# Altium schematic sheet STM8S005C6_Footsprint.schdoc
size A4
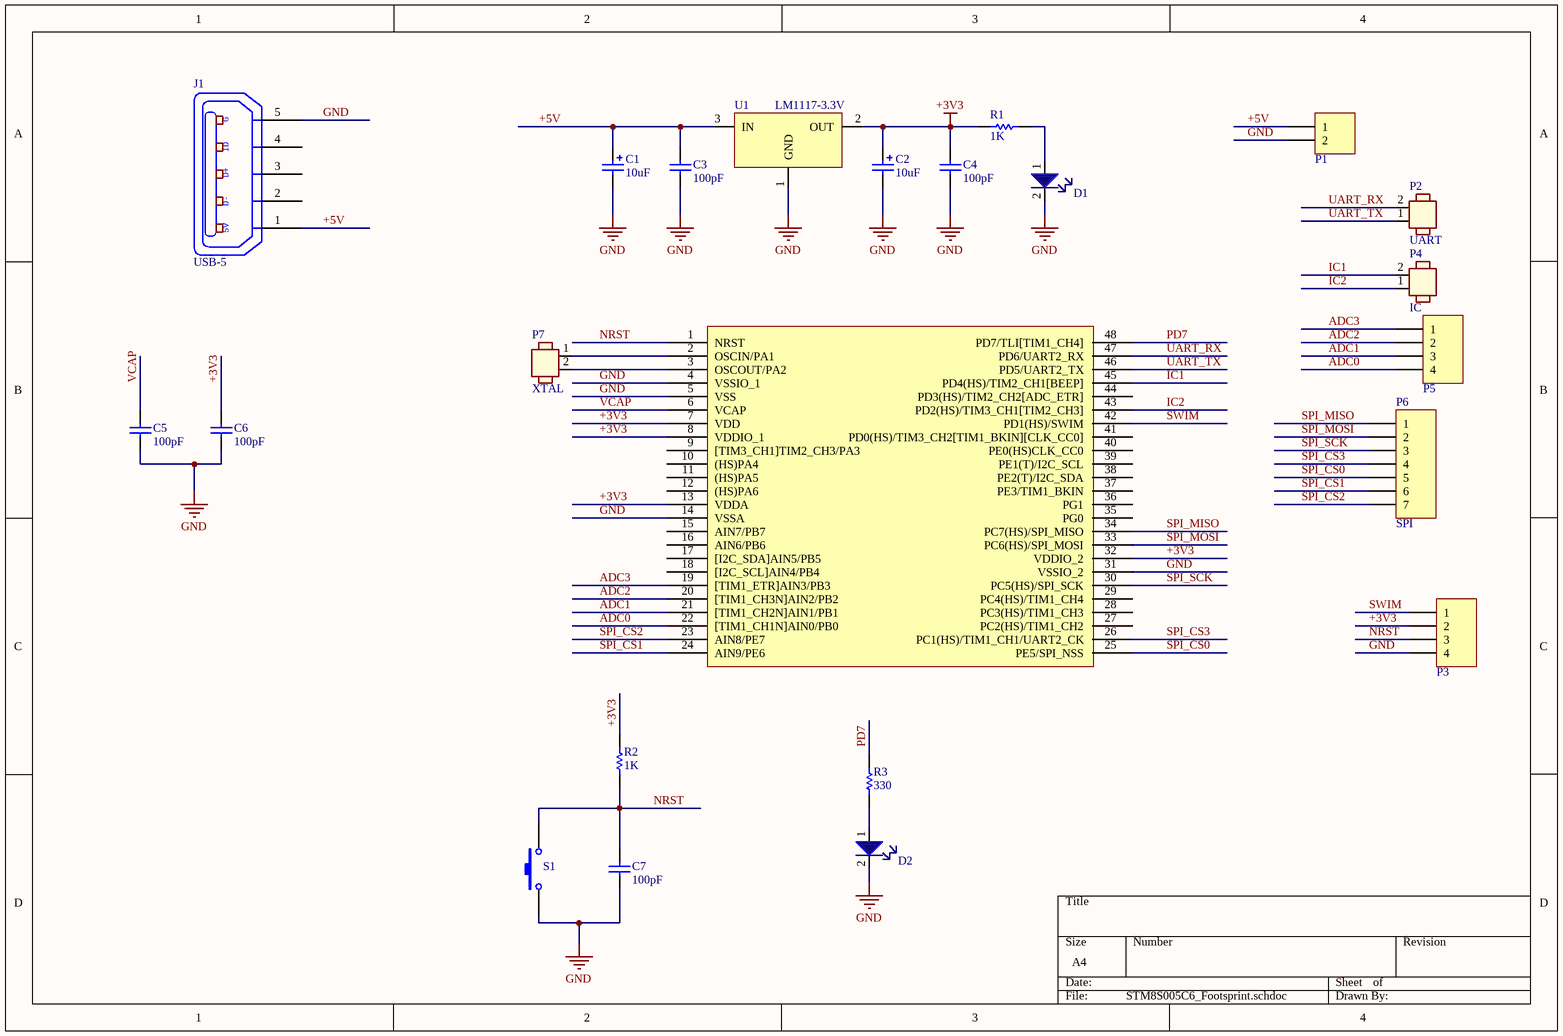
[diagram p0: STM8S005C6_Footsprint.schdoc]

## Parts
C1  value 10uF  [CP1/2]  (hidden comment: Cap Pol)
C2  value 10uF  [CP1/2]  (hidden comment: Cap Pol)
C3  value 100pF  [CAP-SM-0805]  (hidden comment: Cap Non-Pol SMD)
C4  value 100pF  [CAP-SM-0805]  (hidden comment: Cap Non-Pol SMD)
C5  value 100pF  [CAP-SM-0805]  (hidden comment: Cap Non-Pol SMD)
C6  value 100pF  [CAP-SM-0805]  (hidden comment: Cap Non-Pol SMD)
C7  value 100pF  [CAP-SM-0805]  (hidden comment: Cap Non-Pol SMD)
D1  LED  [LED 3mm]  (value not drawn)
D2  LED  [LED 3mm]  (value not drawn)
J1  USB-5  [USB-M2]
P1  Header 2  [JP2]  (value not drawn)
P2  UART  [HDR 2x1]
P3  Header 4  [JP4]  (value not drawn)
P4  IC  [HDR 2x1]
P5  Header 4  [JP4]  (value not drawn)
P6  SPI  [HDR1X7]
P7  XTAL  [HDR 2x1]
R1  value 1K  [RES-SM-0805]  (hidden comment: RESISTOR SMD)
R2  value 1K  [RES-SM-0805]  (hidden comment: RESISTOR SMD)
R3  value 330  [RES-SM-0805]  (hidden comment: RESISTOR SMD)
S1  Tact SW - 2Pin  [SW2]  (value not drawn)
U1  LM1117-3.3V  [SOT223]
U2  STM8S005C6  [STM8S005C6]  (value not drawn)

## Nets
+3V3: C2.1 C4.1 C6.1 P3.2 R1.1 R2.2 U1.2(OUT) U2.7(VDD) U2.8(VDDIO_1) U2.13(VDDA) U2.32(VDDIO_2)
GND: C1.2 C2.2 C3.2 C4.2 C5.2 C6.2 C7.2 D1.2 D2.2 J1.5(P5) P1.2 P3.4 S1.1 U1.1(GND) U2.4(VSSIO_1) U2.5(VSS) U2.14(VSSA) U2.31(VSSIO_2)
+5V: C1.1 C3.1 J1.1(P1) P1.1 U1.3(IN)
ADC0: P5.4 U2.22([TIM1_CH1N]AIN0/PB0)
ADC1: P5.3 U2.21([TIM1_CH2N]AIN1/PB1)
ADC2: P5.2 U2.20([TIM1_CH3N]AIN2/PB2)
ADC3: P5.1 U2.19([TIM1_ETR]AIN3/PB3)
IC1: P4.2 U2.45(PD4(HS)/TIM2_CH1[BEEP])
IC2: P4.1 U2.43(PD2(HS)/TIM3_CH1[TIM2_CH3])
NRST: C7.1 P3.3 R2.1 S1.2 U2.1(NRST)
PD7: R3.2 U2.48(PD7/TLI[TIM1_CH4])
SPI_CS0: P6.5 U2.25(PE5/SPI_NSS)
SPI_CS1: P6.6 U2.24(AIN9/PE6)
SPI_CS2: P6.7 U2.23(AIN8/PE7)
SPI_CS3: P6.4 U2.26(PC1(HS)/TIM1_CH1/UART2_CK)
SPI_MISO: P6.1 U2.34(PC7(HS)/SPI_MISO)
SPI_MOSI: P6.2 U2.33(PC6(HS)/SPI_MOSI)
SPI_SCK: P6.3 U2.30(PC5(HS)/SPI_SCK)
SWIM: P3.1 U2.42(PD1(HS)/SWIM)
UART_RX: P2.2 U2.47(PD6/UART2_RX)
UART_TX: P2.1 U2.46(PD5/UART2_TX)
VCAP: C5.1 U2.6(VCAP)
NetD1_1: D1.1 R1.2
NetD2_1: D2.1 R3.1
NetP7_1: P7.1 U2.2(OSCIN/PA1)
NetP7_2: P7.2 U2.3(OSCOUT/PA2)

Not connected (* = marked no-connect by the designer): J1 2(P2) 3(P3) 4(P4); U2 9([TIM3_CH1]TIM2_CH3/PA3) 10((HS)PA4) 11((HS)PA5) 12((HS)PA6) 15(AIN7/PB7) 16(AIN6/PB6) 17([I2C_SDA]AIN5/PB5) 18([I2C_SCL]AIN4/PB4) 27(PC2(HS)/TIM1_CH2) 28(PC3(HS)/TIM1_CH3) 29(PC4(HS)/TIM1_CH4) 35(PG0) 36(PG1) 37(PE3/TIM1_BKIN) 38(PE2(T)/I2C_SDA) 39(PE1(T)/I2C_SCL) 40(PE0(HS)CLK_CC0) 41(PD0(HS)/TIM3_CH2[TIM1_BKIN][CLK_CC0]) 44(PD3(HS)/TIM2_CH2[ADC_ETR])

## Notes on the sheet
- (in symbol USB-5) G; ID; D+; D-; 5V

## Library data of the parts
C1 C2 = Cap Pol: Polarized Capacitor (Radial)
C3-C7 = Cap Non-Pol SMD: Capacitor
J1 = USB-5: Manufacturer: FCI; Manufacturer Part Number: 10118193-0001LF; Connector Type: USB - micro B; Number of Contacts: 5; Gender: Receptacle; Specifications: USB 2.0; .Creator: MM; .Checked PCB: RF; Supplier 1: Digi-Key; RoHS: RoHS Compliant; Category: Connectors, Interconnects; Stock 1: 28642; Pricing 1: 1=0.46, 10=0.433, 25=0.3712, 50=0.3156, 100=0.3032, 250=0.27224, 500=0.25988 (USD); Packaging: Cut Tape (CT); Mounting Type: Surface Mount, Right Angle, Horizontal; Features: Shielded, Solder Retention; Ingress Protection: -; ComponentLink1URL: http://portal.fciconnect.com/Comergent//fci/drawing/10118193.pdf; ComponentLink1Description: http://portal.fciconnect.com/Comergent//fci/drawing/10118193.pdf; Supplier Part Number 1: 609-4616-1-ND; .Checked SCH: MM
P1 = Header 2: Header, 2-Pin; LatestRevisionDate: 17-Jul-2002; LatestRevisionNote: Re-released for DXP Platform.; Publisher: Altium Limited
P2 P4 P7 = Header 2
P3 P5 = Header 4: Header, 4-Pin; LatestRevisionDate: 17-Jul-2002; LatestRevisionNote: Re-released for DXP Platform.; Publisher: Altium Limited
P6 = Header 7: Header, 7-Pin; LatestRevisionDate: 17-Jul-2002; LatestRevisionNote: Re-released for DXP Platform.; Publisher: Altium Limited
R1-R3 = RESISTOR SMD: Resistor
S1 = Tact SW - 2Pin: Switch button 2 pin
U1 = LM1117: 800mA Low-Dropout Linear Regulator; Creator: Nguyen Ba Bien; Website: http://group3i.net
U2 = STM8S005C6: Value line, 16 MHz STM8S 8-bit MCU, 32 Kbytes Flash, data  EEPROM, 10-bit ADC, timers, UART, SPI, I²C